# Altium schematic sheet ADC.SchDoc
size A4; SheetNumber: 8; SheetTotal: 8
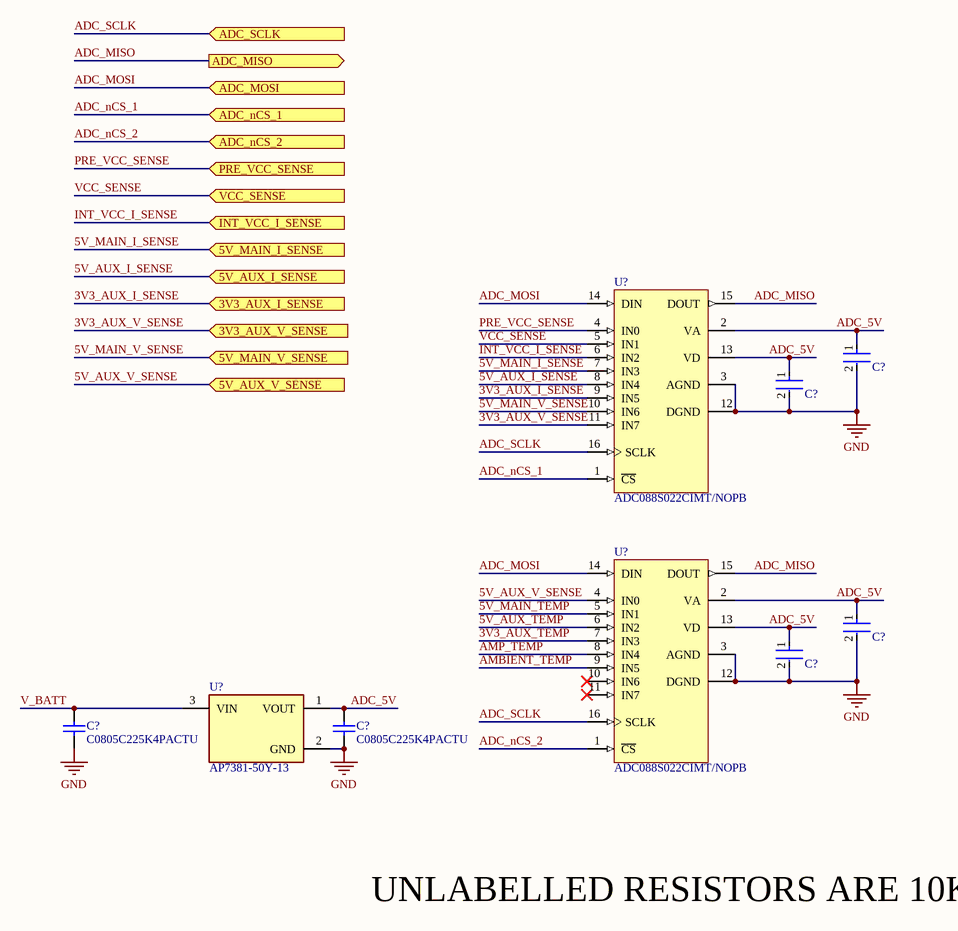
[diagram p0: ADC.SchDoc]

## Parts
(Parts that share a designator on the sheet are numbered #1, #2 ... from top to bottom, then left to right.)
C?#1  C0402C104K8PACTU  [FP-C0402-BB-MFG]  (value not drawn)
C?#2  C0402C104K8PACTU  [FP-C0402-BB-MFG]  (value not drawn)
C?#3  C0402C104K8PACTU  [FP-C0402-BB-MFG]  (value not drawn)
C?#4  C0402C104K8PACTU  [FP-C0402-BB-MFG]  (value not drawn)
C?#5  C0805C225K4PACTU  [CAPC2013X145X50ML20T25]
C?#6  C0805C225K4PACTU  [CAPC2013X145X50ML20T25]
U?#1  ADC088S022CIMT/NOPB  [MTC16_L]
U?#2  ADC088S022CIMT/NOPB  [MTC16_L]
U?#3  AP7381-50Y-13  [FP-SOT89-MFG]

## Ports
3V3_AUX_I_SENSE (in, see CHILD_BOARD[3B], PWR_MGMT[6A]), 3V3_AUX_V_SENSE (in, see CHILD_BOARD[3B]), 5V_AUX_I_SENSE (in, see CHILD_BOARD[3B], PWR_MGMT[6A]), 5V_AUX_V_SENSE (in, see CHILD_BOARD[3B]), 5V_MAIN_I_SENSE (in, see CHILD_BOARD[3B], PWR_MGMT[6A]), 5V_MAIN_V_SENSE (in, see CHILD_BOARD[3A]), ADC_MISO (out), ADC_MOSI (in), ADC_nCS_1 (in), ADC_nCS_2 (in), ADC_SCLK (in), INT_VCC_I_SENSE (in, see CHILD_BOARD[3B], PWR_MGMT[6A]), PRE_VCC_SENSE (in, see CHILD_BOARD[3B], PWR_MGMT[6A]), VCC_SENSE (in, see CHILD_BOARD[3B], PWR_MGMT[6A])

## Nets
GND: C?#1.2 C?#2.2 C?#3.2 C?#4.2 C?#5.1 C?#6.1 U?#1.3(AGND) U?#1.12(DGND) U?#2.3(AGND) U?#2.12(DGND) U?#3.2(GND)
3V3_AUX_I_SENSE: U?#1.9(IN5) ; port 3V3_AUX_I_SENSE
3V3_AUX_TEMP: U?#2.7(IN3)
3V3_AUX_V_SENSE: U?#1.11(IN7) ; port 3V3_AUX_V_SENSE
5V_AUX_I_SENSE: U?#1.8(IN4) ; port 5V_AUX_I_SENSE
5V_AUX_TEMP: U?#2.6(IN2)
5V_AUX_V_SENSE: U?#2.4(IN0) ; port 5V_AUX_V_SENSE
5V_MAIN_I_SENSE: U?#1.7(IN3) ; port 5V_MAIN_I_SENSE
5V_MAIN_TEMP: U?#2.5(IN1)
5V_MAIN_V_SENSE: U?#1.10(IN6) ; port 5V_MAIN_V_SENSE
ADC_5V: C?#1.1 C?#2.1 C?#3.1 C?#4.1 C?#6.2 U?#1.2(VA) U?#1.13(VD) U?#2.2(VA) U?#2.13(VD) U?#3.1(VOUT)
ADC_MISO: U?#1.15(DOUT) U?#2.15(DOUT) ; port ADC_MISO
ADC_MOSI: U?#1.14(DIN) U?#2.14(DIN) ; port ADC_MOSI
ADC_nCS_1: U?#1.1(~{CS}) ; port ADC_nCS_1
ADC_nCS_2: U?#2.1(~{CS}) ; port ADC_nCS_2
ADC_SCLK: U?#1.16(SCLK) U?#2.16(SCLK) ; port ADC_SCLK
AMBIENT_TEMP: U?#2.9(IN5)
AMP_TEMP: U?#2.8(IN4)
INT_VCC_I_SENSE: U?#1.6(IN2) ; port INT_VCC_I_SENSE
PRE_VCC_SENSE: U?#1.4(IN0) ; port PRE_VCC_SENSE
V_BATT: C?#5.2 U?#3.3(VIN)
VCC_SENSE: U?#1.5(IN1) ; port VCC_SENSE

Not connected (* = marked no-connect by the designer): U?#2 10(IN6)* 11(IN7)*

## Notes on the sheet
- UNLABELLED RESISTORS ARE 10K

## Library data of the parts
C?#1-C?#4 = CMP-2008-02046-2: CAP CER 0.1UF 10V X5R 0402; Manufacturer: Kemet; Material: Ceramic; Capacitance: 0.10 μF; Temperature Coefficient: 15%; Tolerance: 0.1; Value: 0.10 μF; Package: C0402-BB; Temperature: -55°C to +125°C; ComponentLink2Description: Datasheet; Temperature Characteristic: X5R; Device Class L1: Passive Components; Height: 0.55mm; Lead Free: Yes; ComponentLink2URL: https://content.kemet.com/datasheets/KEM_C1002_X7R_SMD.pdf; Device Class L2: Capacitors; Temperature Range Low: -55°C; Temperature Range High: +125°C; RoHS: TRUE; Octopart: https://octopart.com/c0402c104k8pactu-kemet-140039; Automotive: No; Mouser Description: Capacitor 100 nF 10 VDC 0402; Category: Cap; Voltage Rating: 10 V; Digikey Description: CAP CER 0.1UF 10V X5R 0402; Ipc Land Pattern Name: CAPC10050X50; Device Class L3: Ceramic Capacitors; Manufacturer Part Number: C0402C104K8PACTU
C?#5 C?#6 = CMP-2007-01026-1: Manufacturer: Kemet; Part Number: C0805C225K4PACTU
U?#1 U?#2 = CMP-0054-00372-2: 8-Channel, 50 kSPS to 200 kSPS, 8-Bit A/D Converter, 16-pin TSSOP, Pb-Free; Manufacturer: National Semiconductor; PackageTopMarking: NSUZXYTT*88S022*CIMT; CompType: ADC IC; PowerWise: Y; ComponentLink2URL: http://www.national.com/pf/AD/ADC088S022.html; RoHS: Y; PackageDescription: Molded TSSOP, Jedec, 5 x 4.4 x 0.9mm Body, 16 Lead, 0.65mm Pitch; DatasheetVersion: Feb-2010; PinCount: 16; ComponentLink1Description: ADC088S022 Datasheet; Code_JEDEC: MO-153-AB; ComponentLink3URL: http://www.national.com/packaging/folders/mtc16.html; PackageVersion: revD, Jun-2003; ComponentLink3Description: MTC16 Package Page; RevisionNote: Component URLs added; ComponentLink1URL: http://www.national.com/ds/AD/ADC088S022.pdf; ComponentLink2Description: ADC088S022 Web Page; PackageReference: MTC16
U?#3 = CMP-12756-000009-1: IC REG LINEAR 5V 150MA SOT89; Manufacturer: Diodes Inc.; Output Type: Fixed; Min Supply Voltage: 3.3V; Max Junction Temp: +125°C; Max Supply Voltage: 40V; Nominal Supply Current: 2.5-25uA; Number Of Outputs: 1; Dropout Voltage: 1000mV; Description: Linear Voltage Regulator IC  1 Output  150mA SOT-89; Manufacturer Part Number: AP7381-50Y-13; RoHS: TRUE; Digikey Description: IC REG LINEAR 5V 150MA SOT89; Output Voltage: 5V; Footprint Url: https://www.diodes.com/assets/Package-Files/SOT89.pdf; Category: IC; Temperature: -40°C to +125°C; ComponentLink2Description: Datasheet; Package: SOT89; Temperature Range Low: -40°C; Temperature Range High: +125°C; ComponentLink2URL: https://www.diodes.com/assets/Datasheets/AP7381.pdf; Device Class L1: Integrated Circuits (ICs); Automotive: No; Output Current: 150mA; Ambient Temperature Range High: +85°C; Octopart: https://octopart.com/ap7381-50y-13-diodes+inc.-87775116; Lead Free: Yes; Device Class L2: Power Management ICs; Height: 1.6mm; Device Class L3: Voltage Regulators - Linear; Ambient Temperature Range Low: -40°C